# Altium schematic sheet FPGA_DDR3&IO.SchDoc
size A1
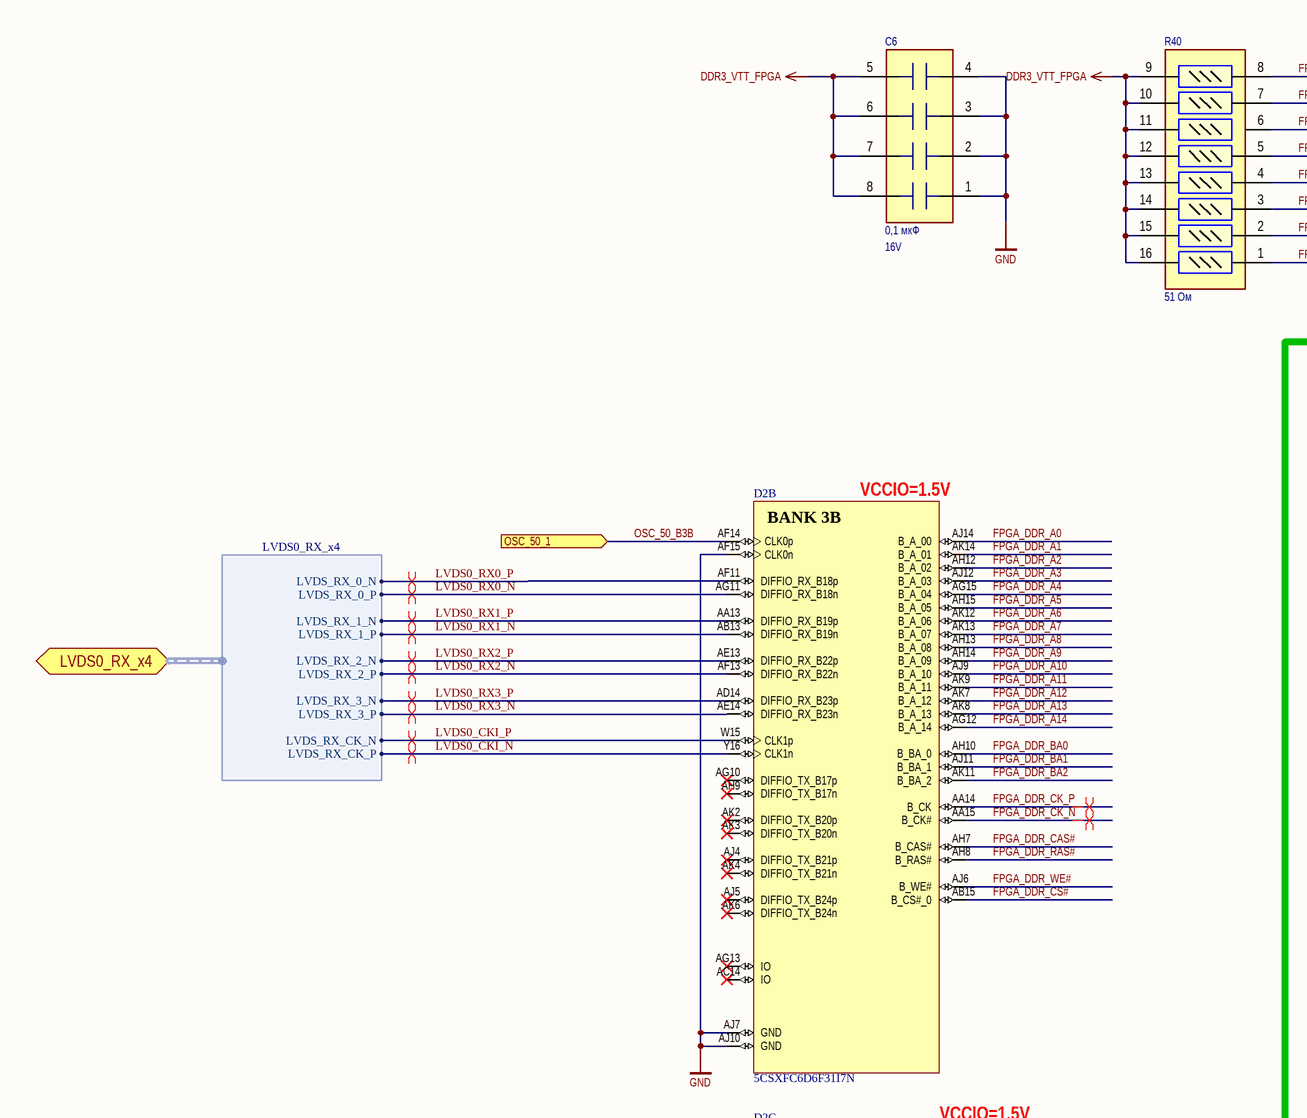
[diagram p0: FPGA_DDR3&IO.SchDoc, top left]
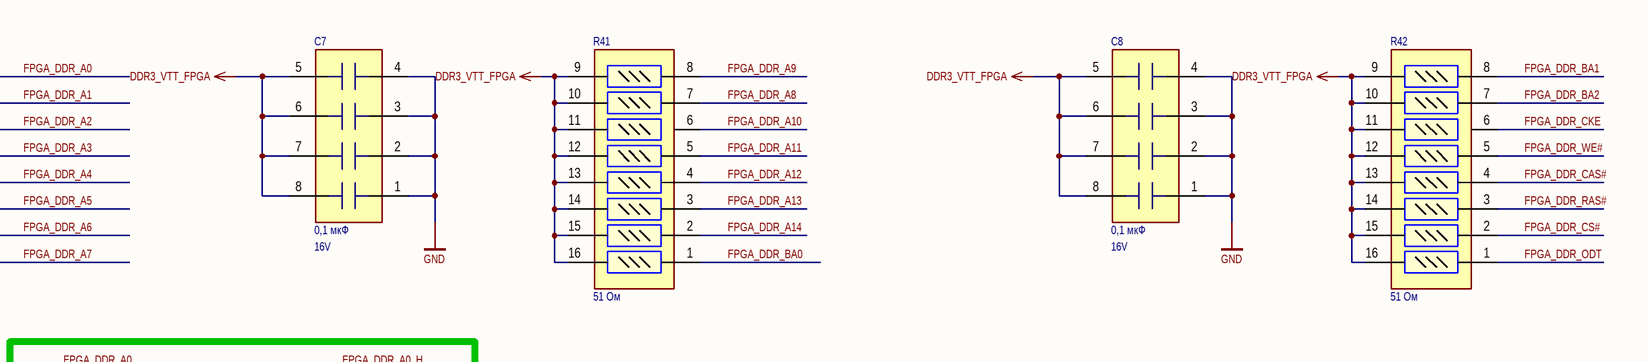
[diagram p1: FPGA_DDR3&IO.SchDoc, top right]
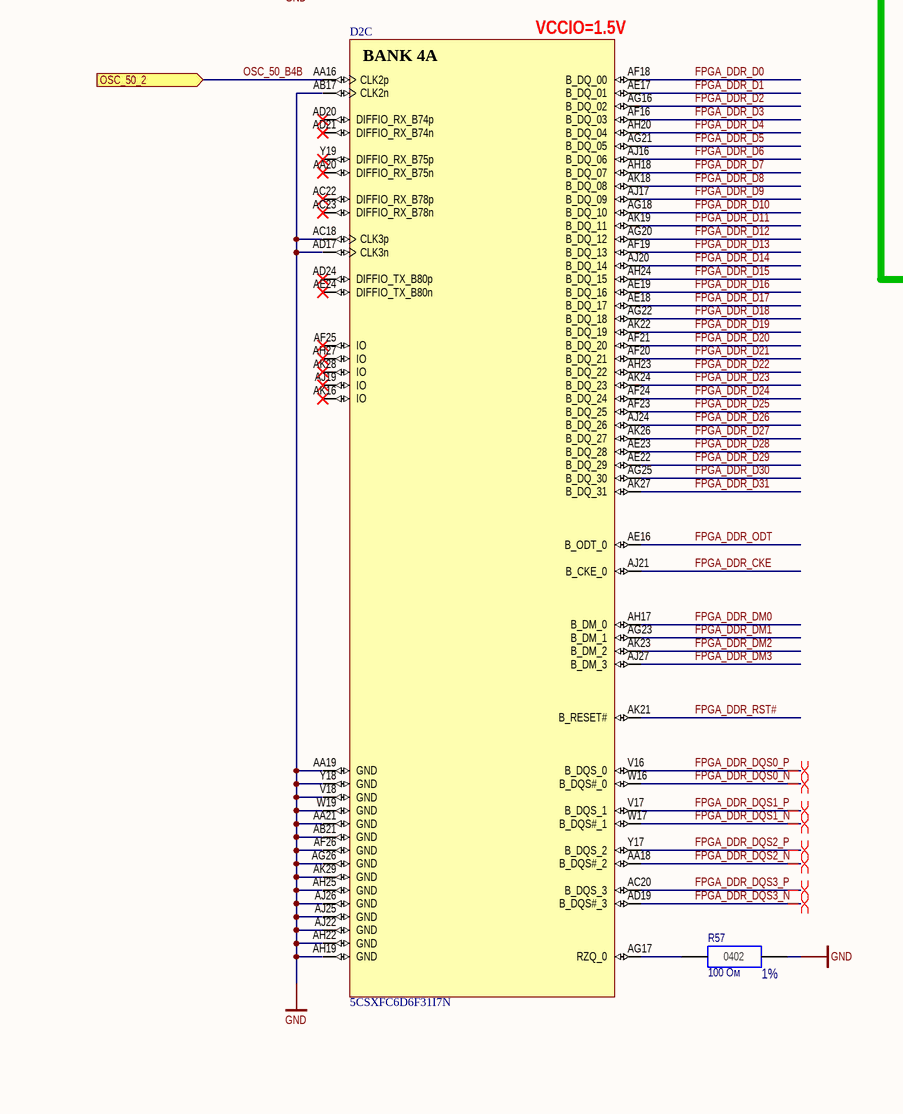
[diagram p2: FPGA_DDR3&IO.SchDoc, bottom left]
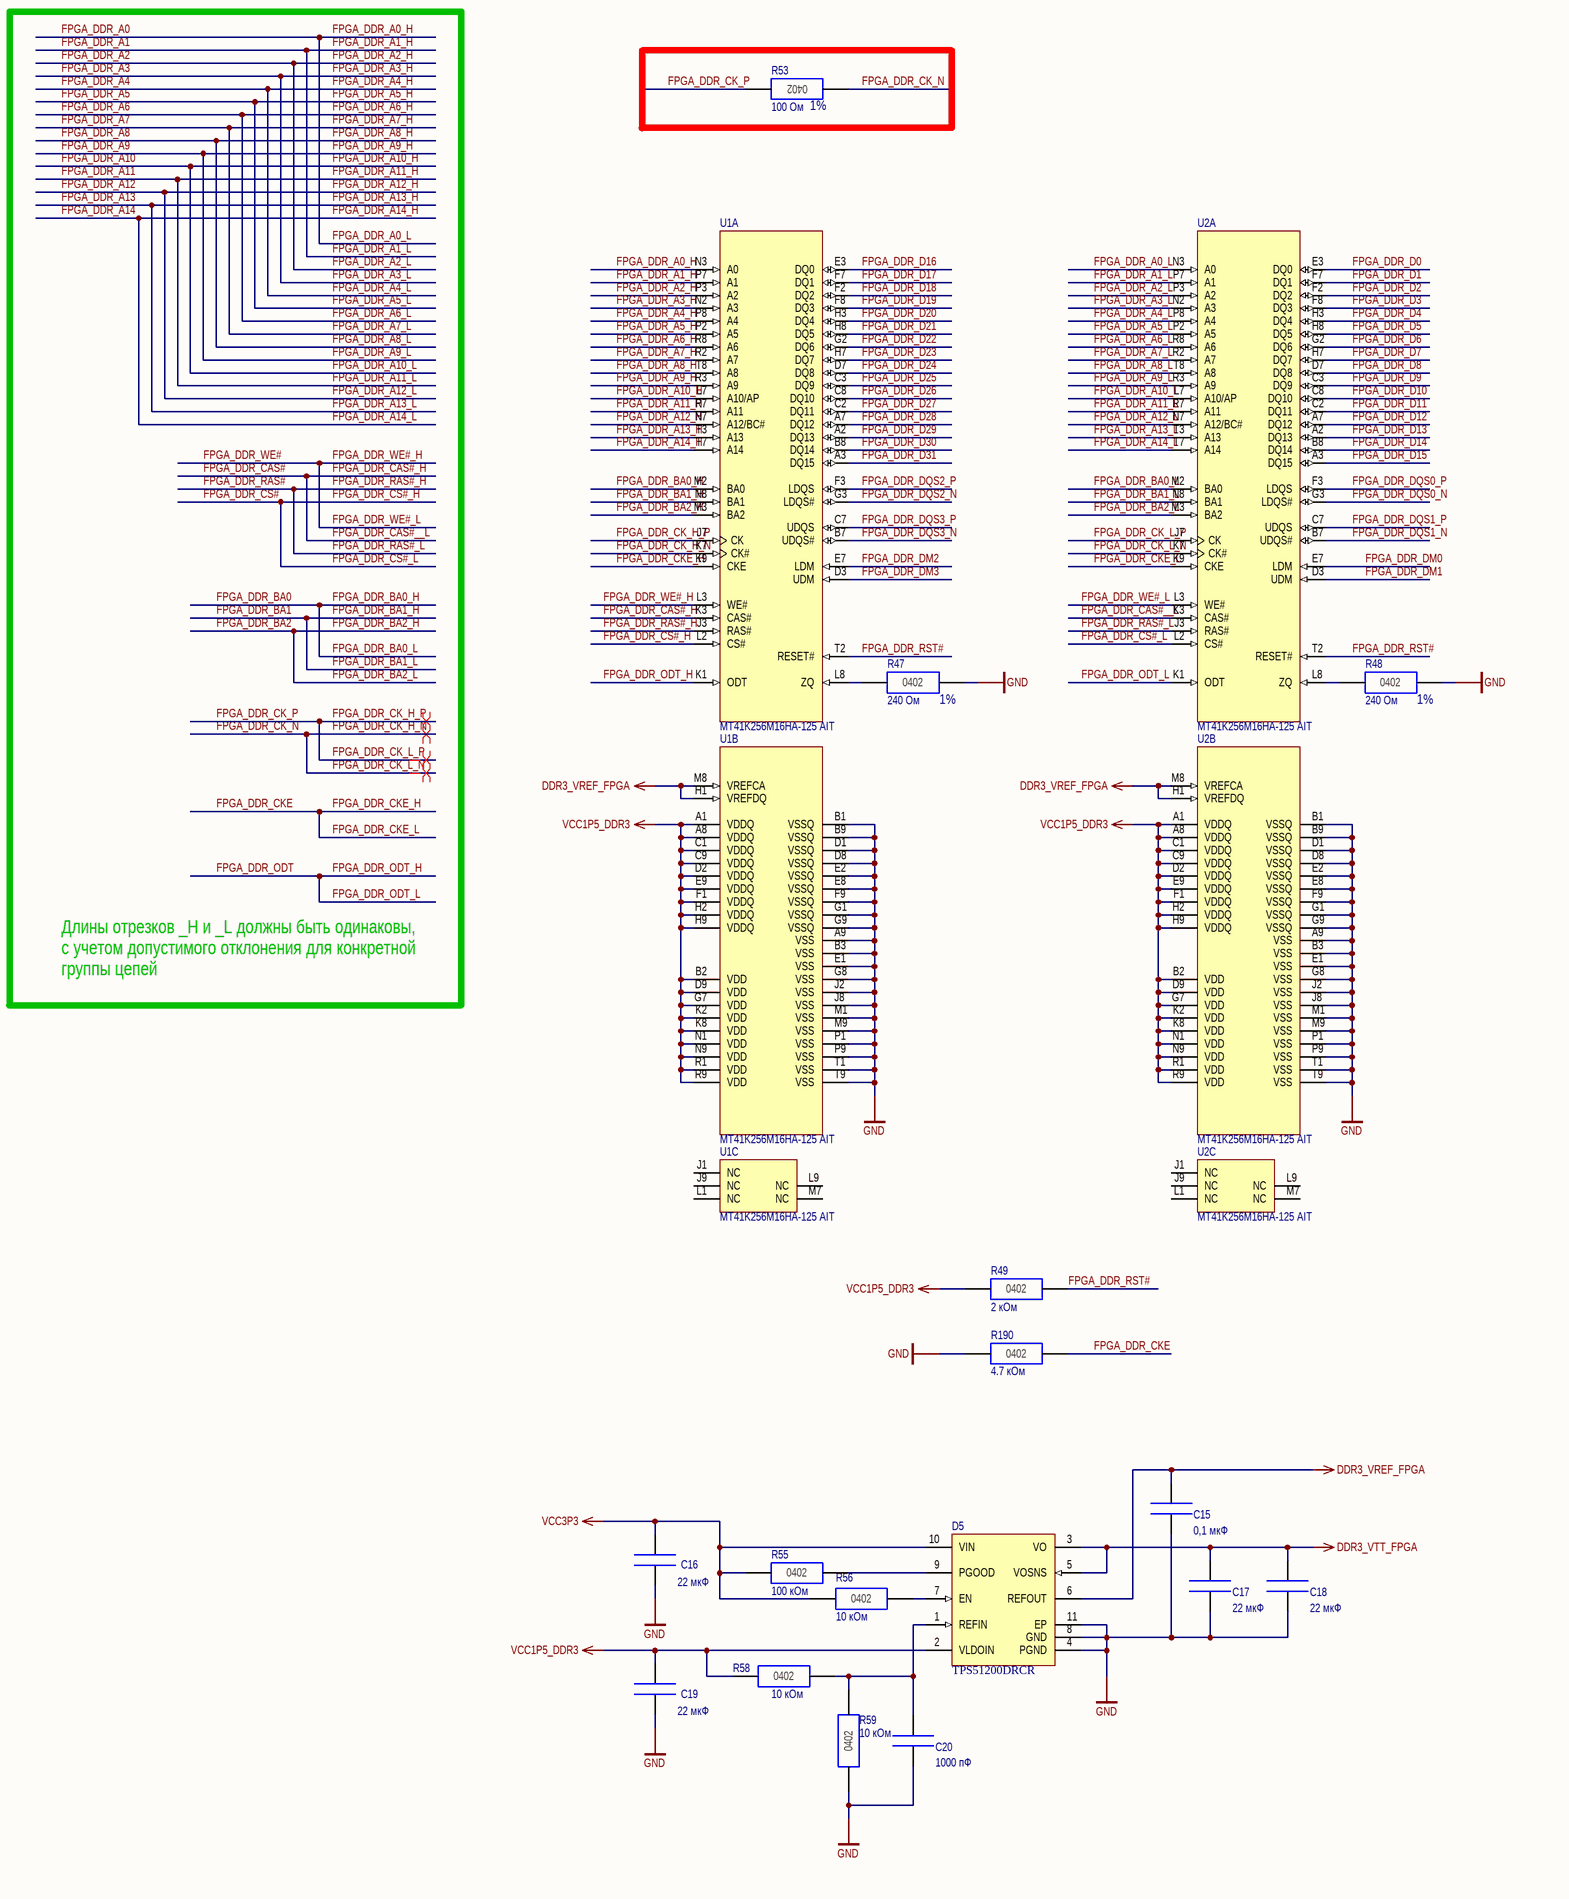
[diagram p3: FPGA_DDR3&IO.SchDoc, bottom right]

## Parts
C6  value 0,1 мкФ  V: 16V  [CAF-80P319X159-8N]  (hidden comment: W3A4YC104KAT2A)
C7  value 0,1 мкФ  V: 16V  [CAF-80P319X159-8N]  (hidden comment: W3A4YC104KAT2A)
C8  value 0,1 мкФ  V: 16V  [CAF-80P319X159-8N]  (hidden comment: W3A4YC104KAT2A)
C15  value 0,1 мкФ  [CC0402(1005)]  (hidden comment: CC0402-X7R-0,1 мкФ-20%-10В)
C16  value 22 мкФ  [CC0402(1005)]  (hidden comment: CC0402-X5R-22 мкФ-20%-6.3В)
C17  value 22 мкФ  [CC0402(1005)]  (hidden comment: CC0402-X5R-22 мкФ-20%-6.3В)
C18  value 22 мкФ  [CC0402(1005)]  (hidden comment: CC0402-X5R-22 мкФ-20%-6.3В)
C19  value 22 мкФ  [CC0402(1005)]  (hidden comment: CC0402-X5R-22 мкФ-20%-6.3В)
C20  value 1000 пФ  [CC0402(1005)]  (hidden comment: CC0402-NP01000 пФ-1%-50В)
D2  5CSXFC6D6F31I7N  [ALTR-FBGA896_A-200]  (parts B,C of 24)
D5  TPS51200DRCR  [TI-DRC10-2400X1650TP_V]
R40  value 51 Ом  [CAT16-J8]  (hidden comment: YC248-JR-07-51 Ом)
R41  value 51 Ом  [CAT16-J8]  (hidden comment: YC248-JR-07-51 Ом)
R42  value 51 Ом  [CAT16-J8]  (hidden comment: YC248-JR-07-51 Ом)
R47  value 240 Ом  TOLERANCE: 1%  [CR0402(1005)]  (hidden comment: CR0402-240 Ом-±TOLERANCE)
R48  value 240 Ом  TOLERANCE: 1%  [CR0402(1005)]  (hidden comment: CR0402-240 Ом-±TOLERANCE)
R49  value 2 кОм  [CR0402(1005)]  (hidden comment: CR0402-2 кОм-±5%)
R53  value 100 Ом  TOLERANCE: 1%  [CR0402(1005)]  (hidden comment: CR0402-100 Ом-±TOLERANCE)
R55  value 100 кОм  [CR0402(1005)]  (hidden comment: CR0402-100 кОм-±5%)
R56  value 10 кОм  [CR0402(1005)]  (hidden comment: CR0402-10 кОм-±5%)
R57  value 100 Ом  TOLERANCE: 1%  [CR0402(1005)]  (hidden comment: CR0402-100 Ом-±TOLERANCE)
R58  value 10 кОм  [CR0402(1005)]  (hidden comment: CR0402-10 кОм-±5%)
R59  value 10 кОм  [CR0402(1005)]  (hidden comment: CR0402-10 кОм-±5%)
R190  value 4.7 кОм  [CR0402(1005)]  (hidden comment: CR0402-4.7 кОм-±5%)
U1  MT41K256M16HA-125 AIT  [MICT-HA-96]  (parts A,B,C of 3)
U2  MT41K256M16HA-125 AIT  [MICT-HA-96]  (parts A,B,C of 3)

## Ports
LVDS0_RX_x4 (harness LVDS0_RX_x4), OSC_50_1 (in), OSC_50_2 (in)

## Harnesses
LVDS0_RX_x4: LVDS_RX_0_P, LVDS_RX_0_N, LVDS_RX_1_P, LVDS_RX_1_N, LVDS_RX_2_P, LVDS_RX_2_N, LVDS_RX_3_P, LVDS_RX_3_N, LVDS_RX_CK_P, LVDS_RX_CK_N

## Nets
DDR3_VREF_FPGA: C15.1(+) D5.6(REFOUT) U1.H1(VREFDQ) U1.M8(VREFCA) U2.H1(VREFDQ) U2.M8(VREFCA)
DDR3_VTT_FPGA: C6.5 C6.6 C6.7 C6.8 C7.5 C7.6 C7.7 C7.8 C8.5 C8.6 C8.7 C8.8 C17.1(+) C18.1(+) D5.3(VO) D5.5(VOSNS) R40.9 R40.10 R40.11 R40.12 R40.13 R40.14 R40.15 R40.16 R41.9 R41.10 R41.11 R41.12 R41.13 R41.14 R41.15 R41.16 R42.9 R42.10 R42.11 R42.12 R42.13 R42.14 R42.15 R42.16
GND: C6.1 C6.2 C6.3 C6.4 C7.1 C7.2 C7.3 C7.4 C8.1 C8.2 C8.3 C8.4 C15.2(-) C16.2(-) C17.2(-) C18.2(-) C19.2(-) C20.2(-) D2.AF15(CLK0n) D2.AJ7(GND) D2.AJ10(GND) D2.AJ22(GND) D5.4(PGND) D5.8(GND) D5.11(EP) R47.2(-) R48.2(-) R57.2(-) R59.1(+) R190.1(+) U1.A9(VSS) U1.B1(VSSQ) U1.B3(VSS) U1.B9(VSSQ) U1.D1(VSSQ) U1.D8(VSSQ) U1.E1(VSS) U1.E2(VSSQ) U1.E8(VSSQ) U1.F9(VSSQ) U1.G1(VSSQ) U1.G8(VSS) U1.G9(VSSQ) U1.J2(VSS) U1.J8(VSS) U1.M1(VSS) U1.M9(VSS) U1.P1(VSS) U1.P9(VSS) U1.T1(VSS) U1.T9(VSS) U2.A9(VSS) U2.B1(VSSQ) U2.B3(VSS) U2.B9(VSSQ) U2.D1(VSSQ) U2.D8(VSSQ) U2.E1(VSS) U2.E2(VSSQ) U2.E8(VSSQ) U2.F9(VSSQ) U2.G1(VSSQ) U2.G8(VSS) U2.G9(VSSQ) U2.J2(VSS) U2.J8(VSS) U2.M1(VSS) U2.M9(VSS) U2.P1(VSS) U2.P9(VSS) U2.T1(VSS) U2.T9(VSS)
VCC1P5_DDR3: C19.1(+) D5.2(VLDOIN) R49.1(+) R58.1(+) U1.A1(VDDQ) U1.A8(VDDQ) U1.B2(VDD) U1.C1(VDDQ) U1.C9(VDDQ) U1.D2(VDDQ) U1.D9(VDD) U1.E9(VDDQ) U1.F1(VDDQ) U1.G7(VDD) U1.H2(VDDQ) U1.H9(VDDQ) U1.K2(VDD) U1.K8(VDD) U1.N1(VDD) U1.N9(VDD) U1.R1(VDD) U1.R9(VDD) U2.A1(VDDQ) U2.A8(VDDQ) U2.B2(VDD) U2.C1(VDDQ) U2.C9(VDDQ) U2.D2(VDDQ) U2.D9(VDD) U2.E9(VDDQ) U2.F1(VDDQ) U2.G7(VDD) U2.H2(VDDQ) U2.H9(VDDQ) U2.K2(VDD) U2.K8(VDD) U2.N1(VDD) U2.N9(VDD) U2.R1(VDD) U2.R9(VDD)
VCC3P3: C16.1(+) D5.10(VIN) R55.1(+) R56.1(+)
FPGA_DDR_A0: D2.AJ14(B_A_00) R40.8 U1.N3(A0) U2.N3(A0)  [also labelled FPGA_DDR_A0_H, FPGA_DDR_A0_L]
FPGA_DDR_A1: D2.AK14(B_A_01) R40.7 U1.P7(A1) U2.P7(A1)  [also labelled FPGA_DDR_A1_H, FPGA_DDR_A1_L]
FPGA_DDR_A2: D2.AH12(B_A_02) R40.6 U1.P3(A2) U2.P3(A2)  [also labelled FPGA_DDR_A2_H, FPGA_DDR_A2_L]
FPGA_DDR_A3: D2.AJ12(B_A_03) R40.5 U1.N2(A3) U2.N2(A3)  [also labelled FPGA_DDR_A3_H, FPGA_DDR_A3_L]
FPGA_DDR_A4: D2.AG15(B_A_04) R40.4 U1.P8(A4) U2.P8(A4)  [also labelled FPGA_DDR_A4_H, FPGA_DDR_A4_L]
FPGA_DDR_A5: D2.AH15(B_A_05) R40.3 U1.P2(A5) U2.P2(A5)  [also labelled FPGA_DDR_A5_H, FPGA_DDR_A5_L]
FPGA_DDR_A6: D2.AK12(B_A_06) R40.2 U1.R8(A6) U2.R8(A6)  [also labelled FPGA_DDR_A6_H, FPGA_DDR_A6_L]
FPGA_DDR_A7: D2.AK13(B_A_07) R40.1 U1.R2(A7) U2.R2(A7)  [also labelled FPGA_DDR_A7_H, FPGA_DDR_A7_L]
FPGA_DDR_A8: D2.AH13(B_A_08) R41.7 U1.T8(A8) U2.T8(A8)  [also labelled FPGA_DDR_A8_H, FPGA_DDR_A8_L]
FPGA_DDR_A9: D2.AH14(B_A_09) R41.8 U1.R3(A9) U2.R3(A9)  [also labelled FPGA_DDR_A9_H, FPGA_DDR_A9_L]
FPGA_DDR_A10: D2.AJ9(B_A_10) R41.6 U1.L7(A10/AP) U2.L7(A10/AP)  [also labelled FPGA_DDR_A10_H, FPGA_DDR_A10_L]
FPGA_DDR_A11: D2.AK9(B_A_11) R41.5 U1.R7(A11) U2.R7(A11)  [also labelled FPGA_DDR_A11_H, FPGA_DDR_A11_L]
FPGA_DDR_A12: D2.AK7(B_A_12) R41.4 U1.N7(A12/BC#) U2.N7(A12/BC#)  [also labelled FPGA_DDR_A12_H, FPGA_DDR_A12_L]
FPGA_DDR_A13: D2.AK8(B_A_13) R41.3 U1.T3(A13) U2.T3(A13)  [also labelled FPGA_DDR_A13_H, FPGA_DDR_A13_L]
FPGA_DDR_A14: D2.AG12(B_A_14) R41.2 U1.T7(A14) U2.T7(A14)  [also labelled FPGA_DDR_A14_H, FPGA_DDR_A14_L]
FPGA_DDR_BA0: D2.AH10(B_BA_0) R41.1 U1.M2(BA0) U2.M2(BA0)  [also labelled FPGA_DDR_BA0_H, FPGA_DDR_BA0_L]
FPGA_DDR_BA1: D2.AJ11(B_BA_1) R42.8 U1.N8(BA1) U2.N8(BA1)  [also labelled FPGA_DDR_BA1_H, FPGA_DDR_BA1_L]
FPGA_DDR_BA2: D2.AK11(B_BA_2) R42.7 U1.M3(BA2) U2.M3(BA2)  [also labelled FPGA_DDR_BA2_H, FPGA_DDR_BA2_L]
FPGA_DDR_CAS#: D2.AH7(B_CAS#) R42.4 U1.K3(CAS#) U2.K3(CAS#)  [also labelled FPGA_DDR_CAS#__L, FPGA_DDR_CAS#_H]
FPGA_DDR_CK_H_N: D2.AA15(B_CK#) R53.1(+) U1.K7(CK#) U2.K7(CK#)  [also labelled FPGA_DDR_CK_L_N, FPGA_DDR_CK_N]
FPGA_DDR_CK_H_P: D2.AA14(B_CK) R53.2(-) U1.J7(CK) U2.J7(CK)  [also labelled FPGA_DDR_CK_L_P, FPGA_DDR_CK_P]
FPGA_DDR_CKE: D2.AJ21(B_CKE_0) R42.6 R190.2(-) U1.K9(CKE) U2.K9(CKE)  [also labelled FPGA_DDR_CKE_H, FPGA_DDR_CKE_L]
FPGA_DDR_CS#: D2.AB15(B_CS#_0) R42.2 U1.L2(CS#) U2.L2(CS#)  [also labelled FPGA_DDR_CS#_H, FPGA_DDR_CS#_L]
FPGA_DDR_D0: D2.AF18(B_DQ_00) U2.E3(DQ0)
FPGA_DDR_D1: D2.AE17(B_DQ_01) U2.F7(DQ1)
FPGA_DDR_D2: D2.AG16(B_DQ_02) U2.F2(DQ2)
FPGA_DDR_D3: D2.AF16(B_DQ_03) U2.F8(DQ3)
FPGA_DDR_D4: D2.AH20(B_DQ_04) U2.H3(DQ4)
FPGA_DDR_D5: D2.AG21(B_DQ_05) U2.H8(DQ5)
FPGA_DDR_D6: D2.AJ16(B_DQ_06) U2.G2(DQ6)
FPGA_DDR_D7: D2.AH18(B_DQ_07) U2.H7(DQ7)
FPGA_DDR_D8: D2.AK18(B_DQ_08) U2.D7(DQ8)
FPGA_DDR_D9: D2.AJ17(B_DQ_09) U2.C3(DQ9)
FPGA_DDR_D10: D2.AG18(B_DQ_10) U2.C8(DQ10)
FPGA_DDR_D11: D2.AK19(B_DQ_11) U2.C2(DQ11)
FPGA_DDR_D12: D2.AG20(B_DQ_12) U2.A7(DQ12)
FPGA_DDR_D13: D2.AF19(B_DQ_13) U2.A2(DQ13)
FPGA_DDR_D14: D2.AJ20(B_DQ_14) U2.B8(DQ14)
FPGA_DDR_D15: D2.AH24(B_DQ_15) U2.A3(DQ15)
FPGA_DDR_D16: D2.AE19(B_DQ_16) U1.E3(DQ0)
FPGA_DDR_D17: D2.AE18(B_DQ_17) U1.F7(DQ1)
FPGA_DDR_D18: D2.AG22(B_DQ_18) U1.F2(DQ2)
FPGA_DDR_D19: D2.AK22(B_DQ_19) U1.F8(DQ3)
FPGA_DDR_D20: D2.AF21(B_DQ_20) U1.H3(DQ4)
FPGA_DDR_D21: D2.AF20(B_DQ_21) U1.H8(DQ5)
FPGA_DDR_D22: D2.AH23(B_DQ_22) U1.G2(DQ6)
FPGA_DDR_D23: D2.AK24(B_DQ_23) U1.H7(DQ7)
FPGA_DDR_D24: D2.AF24(B_DQ_24) U1.D7(DQ8)
FPGA_DDR_D25: D2.AF23(B_DQ_25) U1.C3(DQ9)
FPGA_DDR_D26: D2.AJ24(B_DQ_26) U1.C8(DQ10)
FPGA_DDR_D27: D2.AK26(B_DQ_27) U1.C2(DQ11)
FPGA_DDR_D28: D2.AE23(B_DQ_28) U1.A7(DQ12)
FPGA_DDR_D29: D2.AE22(B_DQ_29) U1.A2(DQ13)
FPGA_DDR_D30: D2.AG25(B_DQ_30) U1.B8(DQ14)
FPGA_DDR_D31: D2.AK27(B_DQ_31) U1.A3(DQ15)
FPGA_DDR_DM0: D2.AH17(B_DM_0) U2.E7(LDM)
FPGA_DDR_DM1: D2.AG23(B_DM_1) U2.D3(UDM)
FPGA_DDR_DM2: D2.AK23(B_DM_2) U1.E7(LDM)
FPGA_DDR_DM3: D2.AJ27(B_DM_3) U1.D3(UDM)
FPGA_DDR_DQS0_N: D2.W16(B_DQS#_0) U2.G3(LDQS#)
FPGA_DDR_DQS0_P: D2.V16(B_DQS_0) U2.F3(LDQS)
FPGA_DDR_DQS1_N: D2.W17(B_DQS#_1) U2.B7(UDQS#)
FPGA_DDR_DQS1_P: D2.V17(B_DQS_1) U2.C7(UDQS)
FPGA_DDR_DQS2_N: D2.AA18(B_DQS#_2) U1.G3(LDQS#)
FPGA_DDR_DQS2_P: D2.Y17(B_DQS_2) U1.F3(LDQS)
FPGA_DDR_DQS3_N: D2.AD19(B_DQS#_3) U1.B7(UDQS#)
FPGA_DDR_DQS3_P: D2.AC20(B_DQS_3) U1.C7(UDQS)
FPGA_DDR_ODT: D2.AE16(B_ODT_0) R42.1 U1.K1(ODT) U2.K1(ODT)  [also labelled FPGA_DDR_ODT_H, FPGA_DDR_ODT_L]
FPGA_DDR_RAS#: D2.AH8(B_RAS#) R42.3 U1.J3(RAS#) U2.J3(RAS#)  [also labelled FPGA_DDR_RAS#_H, FPGA_DDR_RAS#_L]
FPGA_DDR_RST#: D2.AK21(B_RESET#) R49.2(-) U1.T2(RESET#) U2.T2(RESET#)
FPGA_DDR_WE#: D2.AJ6(B_WE#) R42.5 U1.L3(WE#) U2.L3(WE#)  [also labelled FPGA_DDR_WE#_H, FPGA_DDR_WE#_L]
LVDS0_CKI_N: D2.Y16(CLK1n) ; port LVDS0_RX_x4.LVDS_RX_CK_P
LVDS0_CKI_P: D2.W15(CLK1p) ; port LVDS0_RX_x4.LVDS_RX_CK_N
LVDS0_RX0_N: D2.AG11(DIFFIO_RX_B18n) ; port LVDS0_RX_x4.LVDS_RX_0_P
LVDS0_RX0_P: D2.AF11(DIFFIO_RX_B18p) ; port LVDS0_RX_x4.LVDS_RX_0_N
LVDS0_RX1_N: D2.AB13(DIFFIO_RX_B19n) ; port LVDS0_RX_x4.LVDS_RX_1_P
LVDS0_RX1_P: D2.AA13(DIFFIO_RX_B19p) ; port LVDS0_RX_x4.LVDS_RX_1_N
LVDS0_RX2_N: D2.AF13(DIFFIO_RX_B22n) ; port LVDS0_RX_x4.LVDS_RX_2_P
LVDS0_RX2_P: D2.AE13(DIFFIO_RX_B22p) ; port LVDS0_RX_x4.LVDS_RX_2_N
LVDS0_RX3_N: D2.AE14(DIFFIO_RX_B23n) ; port LVDS0_RX_x4.LVDS_RX_3_P
LVDS0_RX3_P: D2.AD14(DIFFIO_RX_B23p) ; port LVDS0_RX_x4.LVDS_RX_3_N
OSC_50_B3B: D2.AF14(CLK0p) ; port OSC_50_1
OSC_50_B4B: D2.AA16(CLK2p) ; port OSC_50_2
NetC20_1: C20.1(+) D5.1(REFIN) R58.2(-) R59.2(-)
NetD2_AG17: D2.AG17(RZQ_0) R57.1(+)
NetD5_7: D5.7(EN) R56.2(-)
NetD5_9: D5.9(PGOOD) R55.2(-)
NetR47_1: R47.1(+) U1.L8(ZQ)
NetR48_1: R48.1(+) U2.L8(ZQ)

Not connected (* = marked no-connect by the designer): D2 AA19(GND) AA20(DIFFIO_RX_B75n)* AA21(GND) AB17(CLK2n) AB21(GND) AC14(IO)* AC18(CLK3p) AC22(DIFFIO_RX_B78p)* AC23(DIFFIO_RX_B78n)* AD17(CLK3n) AD20(DIFFIO_RX_B74p)* AD21(DIFFIO_RX_B74n)* AD24(DIFFIO_TX_B80p)* AE24(DIFFIO_TX_B80n)* AF25(IO)* AF26(GND) AG10(DIFFIO_TX_B17p)* AG13(IO)* AG26(GND) AH9(DIFFIO_TX_B17n)* AH19(GND) AH22(GND) AH25(GND) AH27(IO)* AJ4(DIFFIO_TX_B21p)* AJ5(DIFFIO_TX_B24p)* AJ19(IO)* AJ25(GND) AJ26(GND) AK2(DIFFIO_TX_B20p)* AK3(DIFFIO_TX_B20n)* AK4(DIFFIO_TX_B21n)* AK6(DIFFIO_TX_B24n)* AK16(IO)* AK28(IO)* AK29(GND) V18(GND) W19(GND) Y18(GND) Y19(DIFFIO_RX_B75p)*; U1 J1(NC) J9(NC) L1(NC) L9(NC) M7(NC); U2 J1(NC) J9(NC) L1(NC) L9(NC) M7(NC)

## Layout directives
differential pair: FPGA_DDR_CK_H_N, FPGA_DDR_CK_H_P, FPGA_DDR_DQS0_N, FPGA_DDR_DQS0_P, FPGA_DDR_DQS1_N, FPGA_DDR_DQS1_P, FPGA_DDR_DQS2_N, FPGA_DDR_DQS2_P, FPGA_DDR_DQS3_N, FPGA_DDR_DQS3_P, LVDS0_CKI_N, LVDS0_CKI_P, LVDS0_RX0_N, LVDS0_RX0_P, LVDS0_RX1_N, LVDS0_RX1_P, LVDS0_RX2_N, LVDS0_RX2_P, LVDS0_RX3_N, LVDS0_RX3_P

## Notes on the sheet
- (near D2) VCCIO=1.5V
- Длины отрезков _H и _L должны быть одинаковы, с учетом допустимого отклонения для конкретной группы цепей
- (in symbol 5CSXFC6D6F31I7N, part B) BANK 3B
- (in symbol 5CSXFC6D6F31I7N, part C) BANK 4A
- (in symbol CR0402-#-±5%) 0402

## Library data of the parts
C6-C8 = W3A4YC104KAT2A: Чип конденсатор керамический; T: ±10%; TC: X7R; Supplier 1: Digi-Key; Supplier Part Number 1: 478-2879-2-ND
C15-C20 = CC0402-X7R-#-20%-10В: Чип конденсатор керамический; Supplier 1: Digi-Key
  C15: Supplier Part Number 1: 399-3520-1-ND
  C16-C19: Supplier Part Number 1: CC0402MRX5R4BB226
  C20: Supplier Part Number 1: GRM1555C1H102FA01D
D2 = 5CSXFC6D6F31I7N: Cyclone V SX Family FPGA, 1.07 to 1.13 V Supply, 288 I/O Pins, 6 PLLs, 896-Pin FBGA, Speed Grade 7, Industrial Grade, RoHS Compliant; Manufacturer: Altera; Logic Elements (LE) (K): 110; Speed Grade: 7; DatasheetVersion: Rev. 3.4; PackageVersion: Rev. 2.0, 12/2012; PackageReference: FBGA896_A-200; PackageDescription: 896-Pin FineLine Ball-Grid Array (FBGA), Body 31 x 31 mm, Pitch 1 mm; Supplier 1: Digi-Key; Supplier Part Number 1: 5CSXFC6D6F31I7N-ND; Supplier 2: Mouser; Supplier Part Number 2: 989-5CSXFC6D6F31I7N; Device Group: 5CSXFC6; RoHS: RoHS Compliant; Subcategory: Cyclone V SX; Voltage Supply: 1.07 to 1.13 V; NexusDeviceID: 5CSXFC6D6F31I7N; Mounting Technology: Surface Mount; Code_JEDEC: MS-034; PartNumber: 5CSXFC6D6F31I7N; ComponentLink1Description: Manufacturer URL; ComponentLink1URL: http://www.altera.com; ComponentLink2Description: Datasheet; ComponentLink2URL: http://www.altera.com/literature/hb/cyclone-v/cv_51002.pdf; ComponentLink3Description: Package Specification; ComponentLink3URL: http://www.altera.com/devicepackaging/04R00435-01.pdf; ComponentLink4Description: Device Handbook URL; ComponentLink4URL: http://www.altera.com/literature/hb/cyclone-v/cyclone5_handbook.pdf; ComponentLink5Description: Device Pin-Out URL; ComponentLink5URL: http://www.altera.com/literature/dp/cyclone-v/5CSXFC6.xls; ComponentLink6Description: Product URL; ComponentLink6URL: http://www.buyaltera.com/scripts/partsearch.dll?Detail&name=5CSXFC6D6F31I7N-ND
D5 = TPS51200DRCR: Single Output LDO, 3 A, 2.375 to 3.5 V Input, with DDR Termination, 10-pin SON (DRC), -40 to 85 degC, Green (RoHS & no Sb/Br); Manufacturer: Texas Instruments; Iout(Max)(A): 3; Iq(Typ)(mA): 0.5; Power Good: TRUE; Rating: Catalog; SubFamily: Single Channel LDO; Vin(Max)(V): 3.5; Vin(Min)(V): 2.3; DatasheetVersion: SLUS812; PackageVersion: 4204102-3/L; PackageReference: DRC10-2400X1650TP; PackageDescription: 10-Pin Plastic Small Outline, Body 3 x 3 mm, Pitch 0.5 mm; Supplier 1: Digi-Key; Supplier Part Number 1: 296-26978-2-ND; Supplier 2: Digi-Key; Supplier Part Number 2: 296-26978-1-ND; Supplier 3: Digi-Key; Supplier Part Number 3: 296-26978-6-ND; Supplier 4: Farnell; Supplier Part Number 4: 2126004; Supplier 5: Newark; Supplier Part Number 5: 94T5094; Supplier 6: Newark; Supplier Part Number 6: 11N9832; Supplier 7: Mouser; Supplier Part Number 7: 595-TPS51200DRCR; Eco-Plan: Green (RoHS & no Sb/Br); Mounting Technology: Surface Mount; PartNumber: TPS51200DRCR; ComponentLink1Description: Manufacturer URL; ComponentLink1URL: http://www.ti.com/; ComponentLink2Description: Datasheet; ComponentLink2URL: http://www.ti.com/general/docs/lit/getliterature.tsp?genericPartNumber=TPS51200&fileType=pdf; ComponentLink3Description: Package Specification; ComponentLink3URL: http://www.ti.com/litv/pdf/mpds117k; ComponentLink4Description: URL Link1; ComponentLink4URL: Samples URL:http://www.ti.com/product/tps51200#samples
R40-R42 = YC248-JR-07-#: Набор чип резисторов; P: 0.062 Вт; Supplier 1: Digi-Key; Supplier Part Number 1: YC248-JR-0751RL
R47 R48 R53 R57 = CR0402-#-±5%: Чип резистор; Maximum Working Voltage: 50 В; Supplier 1: Digi-Key
  R47 R48: Supplier Part Number 1: 311-240JRTR-ND
  R53 R57: Supplier Part Number 1: 311-100JRTR-ND
R49 R55 R56 R58 R59 R190 = CR0402-#-±5%: Чип резистор; Maximum Working Voltage: 50 В; TOLERANCE: 5%; Supplier 1: Digi-Key
  R49: Supplier Part Number 1: 311-2.0KJRTR-ND
  R55: Supplier Part Number 1: 311-100KJRTR-ND
  R56 R58 R59: Supplier Part Number 1: 311-10.0KJRTR-ND
  R190: Supplier Part Number 1: 311-4.7KJRTR-ND
U1 U2 = MT41K256M16HA-125 AIT: 4Gb DDR3-1600 SDRAM, 256Mb x 16, 1.25ns, 1.35V, -40 to 95 degC, 96-Ball FBGA, Pb-Free; Manufacturer: Micron; CL: CL = 11; Clock Rate: 800 MHz; Op. Temp.: -40C to +95C; DatasheetVersion: Rev. E; PackageVersion: Rev.E; PackageReference: MICT-HA-96; PackageDescription: 96-Ball Fine-Pitch Ball Grid Array, 14 x 9 mm, Pitch 0.8 mm; Cycle Time: 1.25ns; Data Rate: DDR3-1600; Density: 4Gb; Depth: 256Mb; Package: FBGA; Pin Count: 96-ball; RoHS: Yes; Voltage: 1.35V; Width: x16; Mounting Technology: Surface Mount; PartNumber: MT41K256M16HA-125 AIT; ComponentLink1Description: Manufacturer URL; ComponentLink1URL: http://www.micron.com/; ComponentLink2Description: Datasheet; ComponentLink2URL: http://www.micron.com/~/media/Documents/Products/Data%20Sheet/DRAM/4Gb_1_35V_DDR3L.pdf; ComponentLink3Description: Package Specification; ComponentLink3URL: http://www.micron.com/~/media/Documents/Products/Data%20Sheet/DRAM/4Gb_1_35V_DDR3L.pdf